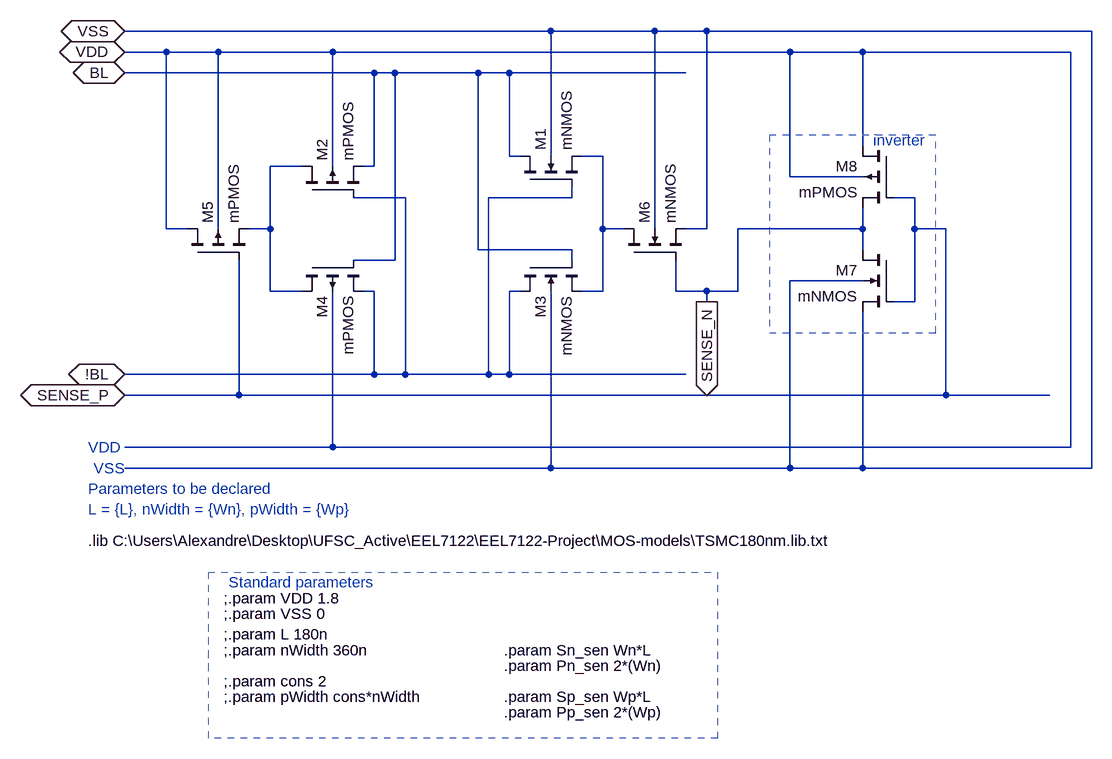
[diagram p0: schematic SEN_AMP.asc]
SEN_AMP.asc, the LTspice schematic file:
Version 4
SHEET 1 1188 680
WIRE 240 -896 -416 -896
WIRE 400 -896 240 -896
WIRE 480 -896 400 -896
WIRE 1072 -896 480 -896
WIRE -352 -864 -416 -864
WIRE -272 -864 -352 -864
WIRE -96 -864 -272 -864
WIRE 608 -864 -96 -864
WIRE 720 -864 608 -864
WIRE 1040 -864 720 -864
WIRE -32 -832 -416 -832
WIRE 0 -832 -32 -832
WIRE 128 -832 0 -832
WIRE 176 -832 128 -832
WIRE 448 -832 176 -832
WIRE 720 -720 720 -864
WIRE 176 -704 176 -832
WIRE 192 -704 176 -704
WIRE 240 -704 240 -896
WIRE 320 -704 288 -704
WIRE -144 -688 -192 -688
WIRE -96 -688 -96 -864
WIRE -32 -688 -32 -832
WIRE -32 -688 -48 -688
WIRE 608 -672 608 -864
WIRE 720 -672 608 -672
WIRE 16 -640 -64 -640
WIRE 272 -640 272 -656
WIRE 272 -640 144 -640
WIRE 800 -640 768 -640
WIRE -352 -592 -352 -864
WIRE -320 -592 -352 -592
WIRE -272 -592 -272 -864
WIRE -192 -592 -192 -688
WIRE -192 -592 -224 -592
WIRE 320 -592 320 -704
WIRE 352 -592 320 -592
WIRE 400 -592 400 -896
WIRE 480 -592 480 -896
WIRE 480 -592 448 -592
WIRE 720 -592 720 -624
WIRE 720 -592 528 -592
WIRE 800 -592 800 -640
WIRE 848 -592 800 -592
WIRE 128 -560 128 -832
WIRE 272 -560 128 -560
WIRE 720 -560 720 -592
WIRE 0 -544 0 -832
WIRE 0 -544 -64 -544
WIRE 272 -544 272 -560
WIRE 720 -512 608 -512
WIRE -192 -496 -192 -592
WIRE -144 -496 -192 -496
WIRE -32 -496 -48 -496
WIRE 192 -496 176 -496
WIRE 320 -496 320 -592
WIRE 320 -496 288 -496
WIRE 432 -496 432 -544
WIRE 480 -496 432 -496
WIRE 528 -496 528 -592
WIRE 528 -496 480 -496
WIRE 480 -480 480 -496
WIRE 800 -480 800 -592
WIRE 800 -480 768 -480
WIRE -32 -368 -32 -496
WIRE -32 -368 -416 -368
WIRE 16 -368 16 -640
WIRE 16 -368 -32 -368
WIRE 144 -368 144 -640
WIRE 144 -368 16 -368
WIRE 176 -368 176 -496
WIRE 176 -368 144 -368
WIRE 448 -368 176 -368
WIRE -240 -336 -240 -544
WIRE -240 -336 -416 -336
WIRE 848 -336 848 -592
WIRE 848 -336 -240 -336
WIRE 1008 -336 848 -336
WIRE -96 -256 -96 -496
WIRE -96 -256 -416 -256
WIRE 1040 -256 1040 -864
WIRE 1040 -256 -96 -256
WIRE 240 -224 240 -496
WIRE 240 -224 -416 -224
WIRE 608 -224 608 -512
WIRE 608 -224 240 -224
WIRE 720 -224 720 -464
WIRE 720 -224 608 -224
WIRE 1072 -224 1072 -896
WIRE 1072 -224 720 -224
FLAG -416 -864 VDD
IOPIN -416 -864 BiDir
FLAG -416 -832 BL
IOPIN -416 -832 BiDir
FLAG -416 -368 !BL
IOPIN -416 -368 BiDir
FLAG -416 -896 VSS
IOPIN -416 -896 BiDir
FLAG -416 -336 SENSE_P
IOPIN -416 -336 BiDir
FLAG 480 -480 SENSE_N
IOPIN 480 -480 Out
SYMBOL nmos4 192 -656 R270
SYMATTR InstName M1
SYMATTR Value mNMOS
SYMATTR Value2 l={L} w={nWidth} ad={Sn_sen} as={Sn_sen} pd={Pn_sen} ps={Pn_sen} m=1
SYMBOL pmos4 -144 -640 R270
SYMATTR InstName M2
SYMATTR Value mPMOS
SYMATTR Value2 l=180n w={pWidth} ad={Sp_sen} as={Sp_sen} pd={Pp_sen} ps={Pp_sen} m=1
SYMBOL nmos4 192 -544 M90
SYMATTR InstName M3
SYMATTR Value mNMOS
SYMATTR Value2 l={L} w={nWidth} ad={Sn_sen} as={Sn_sen} pd={Pn_sen} ps={Pn_sen} m=1
SYMBOL pmos4 -144 -544 M90
SYMATTR InstName M4
SYMATTR Value mPMOS
SYMATTR Value2 l=180n w={pWidth} ad={Sp_sen} as={Sp_sen} pd={Pp_sen} ps={Pp_sen} m=1
SYMBOL pmos4 -320 -544 R270
SYMATTR InstName M5
SYMATTR Value mPMOS
SYMATTR Value2 l=180n w={pWidth} ad={Sp_sen} as={Sp_sen} pd={Pp_sen} ps={Pp_sen} m=1
SYMBOL nmos4 352 -544 R270
SYMATTR InstName M6
SYMATTR Value mNMOS
SYMATTR Value2 l={L} w={nWidth} ad={Sn_sen} as={Sn_sen} pd={Pn_sen} ps={Pn_sen} m=1
SYMBOL nmos4 768 -560 M0
SYMATTR InstName M7
SYMATTR Value mNMOS
SYMATTR Value2 l={L} w={nWidth} ad={Sn_sen} as={Sn_sen} pd={Pn_sen} ps={Pn_sen} m=1
SYMBOL pmos4 768 -720 M0
SYMATTR InstName M8
SYMATTR Value mPMOS
SYMATTR Value2 l=180n w={pWidth} ad={Sp_sen} as={Sp_sen} pd={Pp_sen} ps={Pp_sen} m=1
TEXT -472 -112 Left 2 !.lib C:\\Users\\Alexandre\\Desktop\\UFSC_Active\\EEL7122\\EEL7122-Project\\MOS-models\\TSMC180nm.lib.txt
TEXT -256 -48 Left 2 ;Standard parameters
TEXT -264 -24 Left 2 !;.param VDD 1.8
TEXT -264 0 Left 2 !;.param VSS 0
TEXT -264 56 Left 2 !;.param nWidth 360n
TEXT -264 128 Left 2 !;.param pWidth cons*nWidth
TEXT 168 128 Left 2 !.param Sp_sen Wp*L
TEXT 168 152 Left 2 !.param Pp_sen 2*(Wp)
TEXT 168 56 Left 2 !.param Sn_sen Wn*L
TEXT 168 80 Left 2 !.param Pn_sen 2*(Wn)
TEXT -264 104 Left 2 !;.param cons 2
TEXT -264 32 Left 2 !;.param L 180n
TEXT -472 -192 Left 2 ;Parameters to be declared\nL = {L}, nWidth = {Wn}, pWidth = {Wp}
TEXT -472 -256 Left 2 ;VDD
TEXT -464 -224 Left 2 ;VSS
TEXT 736 -728 Left 2 ;inverter
LINE Normal -288 -64 336 -64 2
LINE Normal -288 -64 -288 160 2
LINE Normal -288 160 -288 192 2
LINE Normal -288 16 -288 96 2
LINE Normal 496 192 -288 192 2
LINE Normal 496 -64 496 192 2
LINE Normal 336 -64 496 -64 2
LINE Normal 576 -736 576 -432 2
LINE Normal 832 -736 576 -736 2
LINE Normal 832 -432 832 -736 2
LINE Normal 576 -432 832 -432 2

The netlist it stands for:
* SEN_AMP.asc
M1 BL !BL N001 VSS mNMOS l={L} w={nWidth} ad={Sn_sen} as={Sn_sen} pd={Pn_sen} ps={Pn_sen} m=1
M2 N002 !BL BL VDD mPMOS l=180n w={pWidth} ad={Sp_sen} as={Sp_sen} pd={Pp_sen} ps={Pp_sen} m=1
M3 !BL BL N001 VSS mNMOS l={L} w={nWidth} ad={Sn_sen} as={Sn_sen} pd={Pn_sen} ps={Pn_sen} m=1
M4 N002 BL !BL VDD mPMOS l=180n w={pWidth} ad={Sp_sen} as={Sp_sen} pd={Pp_sen} ps={Pp_sen} m=1
M5 VDD SENSE_P N002 VDD mPMOS l=180n w={pWidth} ad={Sp_sen} as={Sp_sen} pd={Pp_sen} ps={Pp_sen} m=1
M6 N001 SENSE_N VSS VSS mNMOS l={L} w={nWidth} ad={Sn_sen} as={Sn_sen} pd={Pn_sen} ps={Pn_sen} m=1
M7 SENSE_N SENSE_P VSS VSS mNMOS l={L} w={nWidth} ad={Sn_sen} as={Sn_sen} pd={Pn_sen} ps={Pn_sen} m=1
M8 VDD SENSE_P SENSE_N VDD mPMOS l=180n w={pWidth} ad={Sp_sen} as={Sp_sen} pd={Pp_sen} ps={Pp_sen} m=1
.model NMOS NMOS
.model PMOS PMOS
.lib standard.mos
.lib C:\Users\Alexandre\Desktop\UFSC_Active\EEL7122\EEL7122-Project\MOS-models\TSMC180nm.lib.txt
* Standard parameters
;.param VDD 1.8
;.param VSS 0
;.param nWidth 360n
;.param pWidth cons*nWidth
.param Sp_sen Wp*L
.param Pp_sen 2*(Wp)
.param Sn_sen Wn*L
.param Pn_sen 2*(Wn)
;.param cons 2
;.param L 180n
* Parameters to be declared
* L = {L}, nWidth = {Wn}, pWidth = {Wp}
* VDD
* VSS
* inverter
.backanno
.end